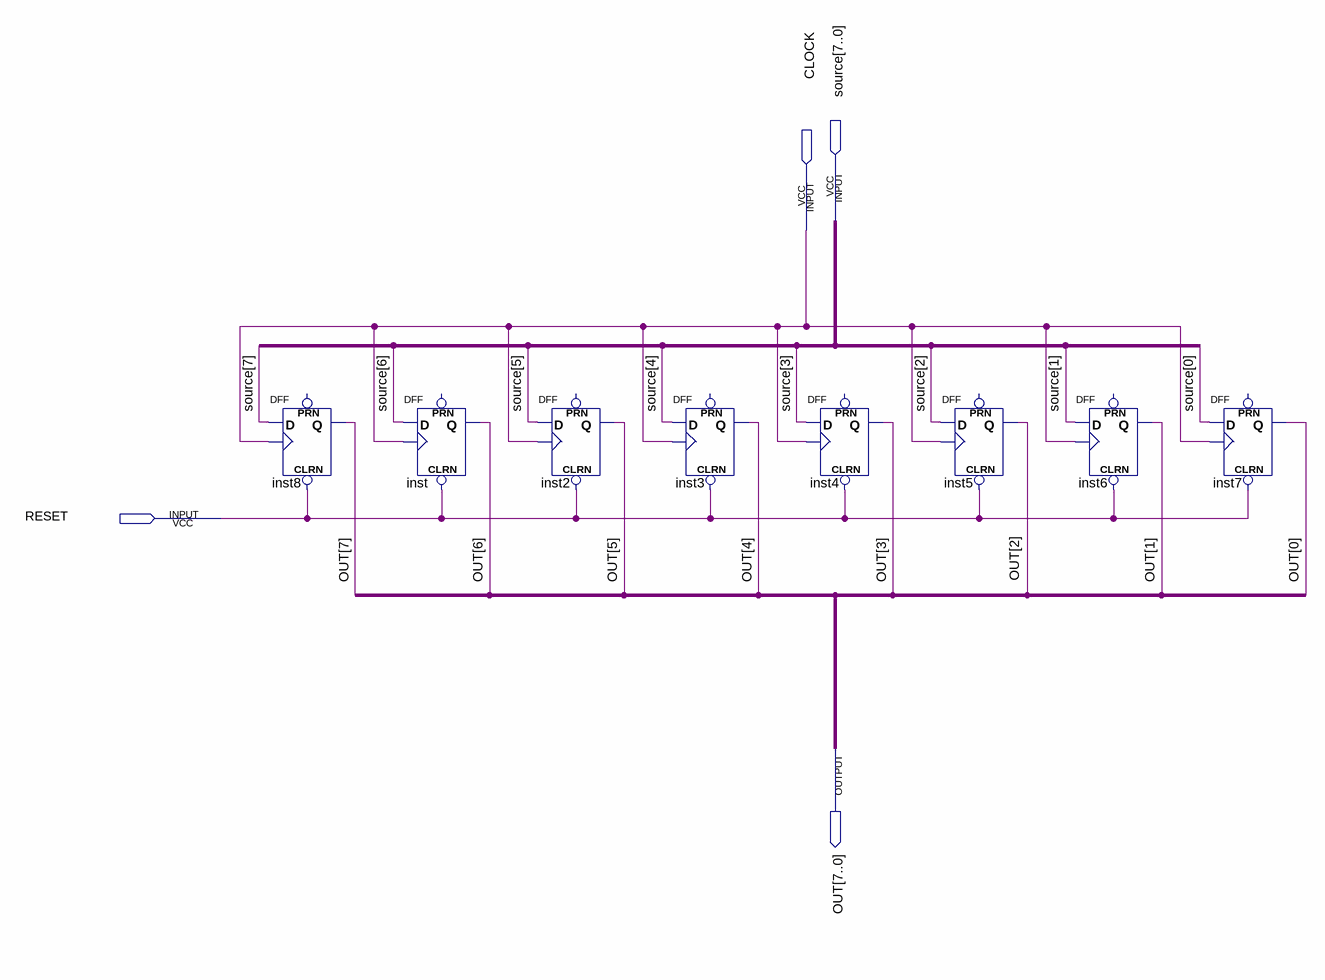
[diagram p0: schematic sheet]
// Quartus schematic regA.bdf as structural Verilog: 8 symbols, 4 pins
module regA (
  input  [7:0] source,
  input  CLOCK,
  input  RESET,
  output [7:0] OUT
);

  DFF inst8 (.CLRN(RESET), .CLK(CLOCK), .D(source[7]), .Q(OUT[7]));  // open: PRN
  DFF inst (.CLRN(RESET), .CLK(CLOCK), .D(source[6]), .Q(OUT[6]));  // open: PRN
  DFF inst2 (.CLRN(RESET), .CLK(CLOCK), .D(source[5]), .Q(OUT[5]));  // open: PRN
  DFF inst3 (.CLRN(RESET), .CLK(CLOCK), .D(source[4]), .Q(OUT[4]));  // open: PRN
  DFF inst4 (.CLRN(RESET), .CLK(CLOCK), .D(source[3]), .Q(OUT[3]));  // open: PRN
  DFF inst5 (.CLRN(RESET), .CLK(CLOCK), .D(source[2]), .Q(OUT[2]));  // open: PRN
  DFF inst6 (.CLRN(RESET), .CLK(CLOCK), .D(source[1]), .Q(OUT[1]));  // open: PRN
  DFF inst7 (.CLRN(RESET), .CLK(CLOCK), .D(source[0]), .Q(OUT[0]));  // open: PRN
endmodule
